# Altium schematic sheet ST3485EBDR.schdoc
size 124 x 99 mm
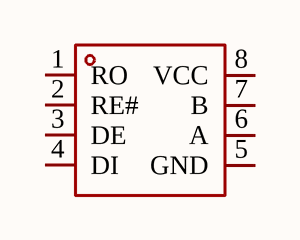
[diagram p0: ST3485EBDR.schdoc]

## Parts
U?  ST3485EBDR  [SO-8_L4.9-W3.9-P1.27-LS5.9-BL]  (value not drawn)

## Nets

Not connected (* = marked no-connect by the designer): U? 1(RO) 2(RE#) 3(DE) 4(DI) 5(GND) 6(A) 7(B) 8(VCC)

## Library data of the parts
U? = ST3485EBDR: Manufacturer: ST(意法半导体); Add into BOM: yes; Types: transceiver; Supply Voltage: 3V~3.6V; Data Rate: 15Mbps; Driver/receiver: 1/1; Node Number: 64; ESD Protect: ±12kV; Whether the isolation: NO; Symbol: ST3485EBDR; Device: ST3485EBDR; LCSC Part Name: 3.3V供电 15Mbps 带静电保护收发器; Supplier Part: C75809; Manufacturer Part: ST3485EBDR; Supplier Footprint: SO-8; JLCPCB Part Class: Extended Part; Datasheet: https://atta.szlcsc.com/upload/public/pdf/source/20181012/C75809_EC9EE9FC1B4AC7950854237FAEE73CA1.pdf; Supplier: LCSC; Convert to PCB: yes; Operating Temperature: -40℃~+85℃